# EAGLE design comms_sys_schematic_no_ch340G (EAGLE 9.5.2)
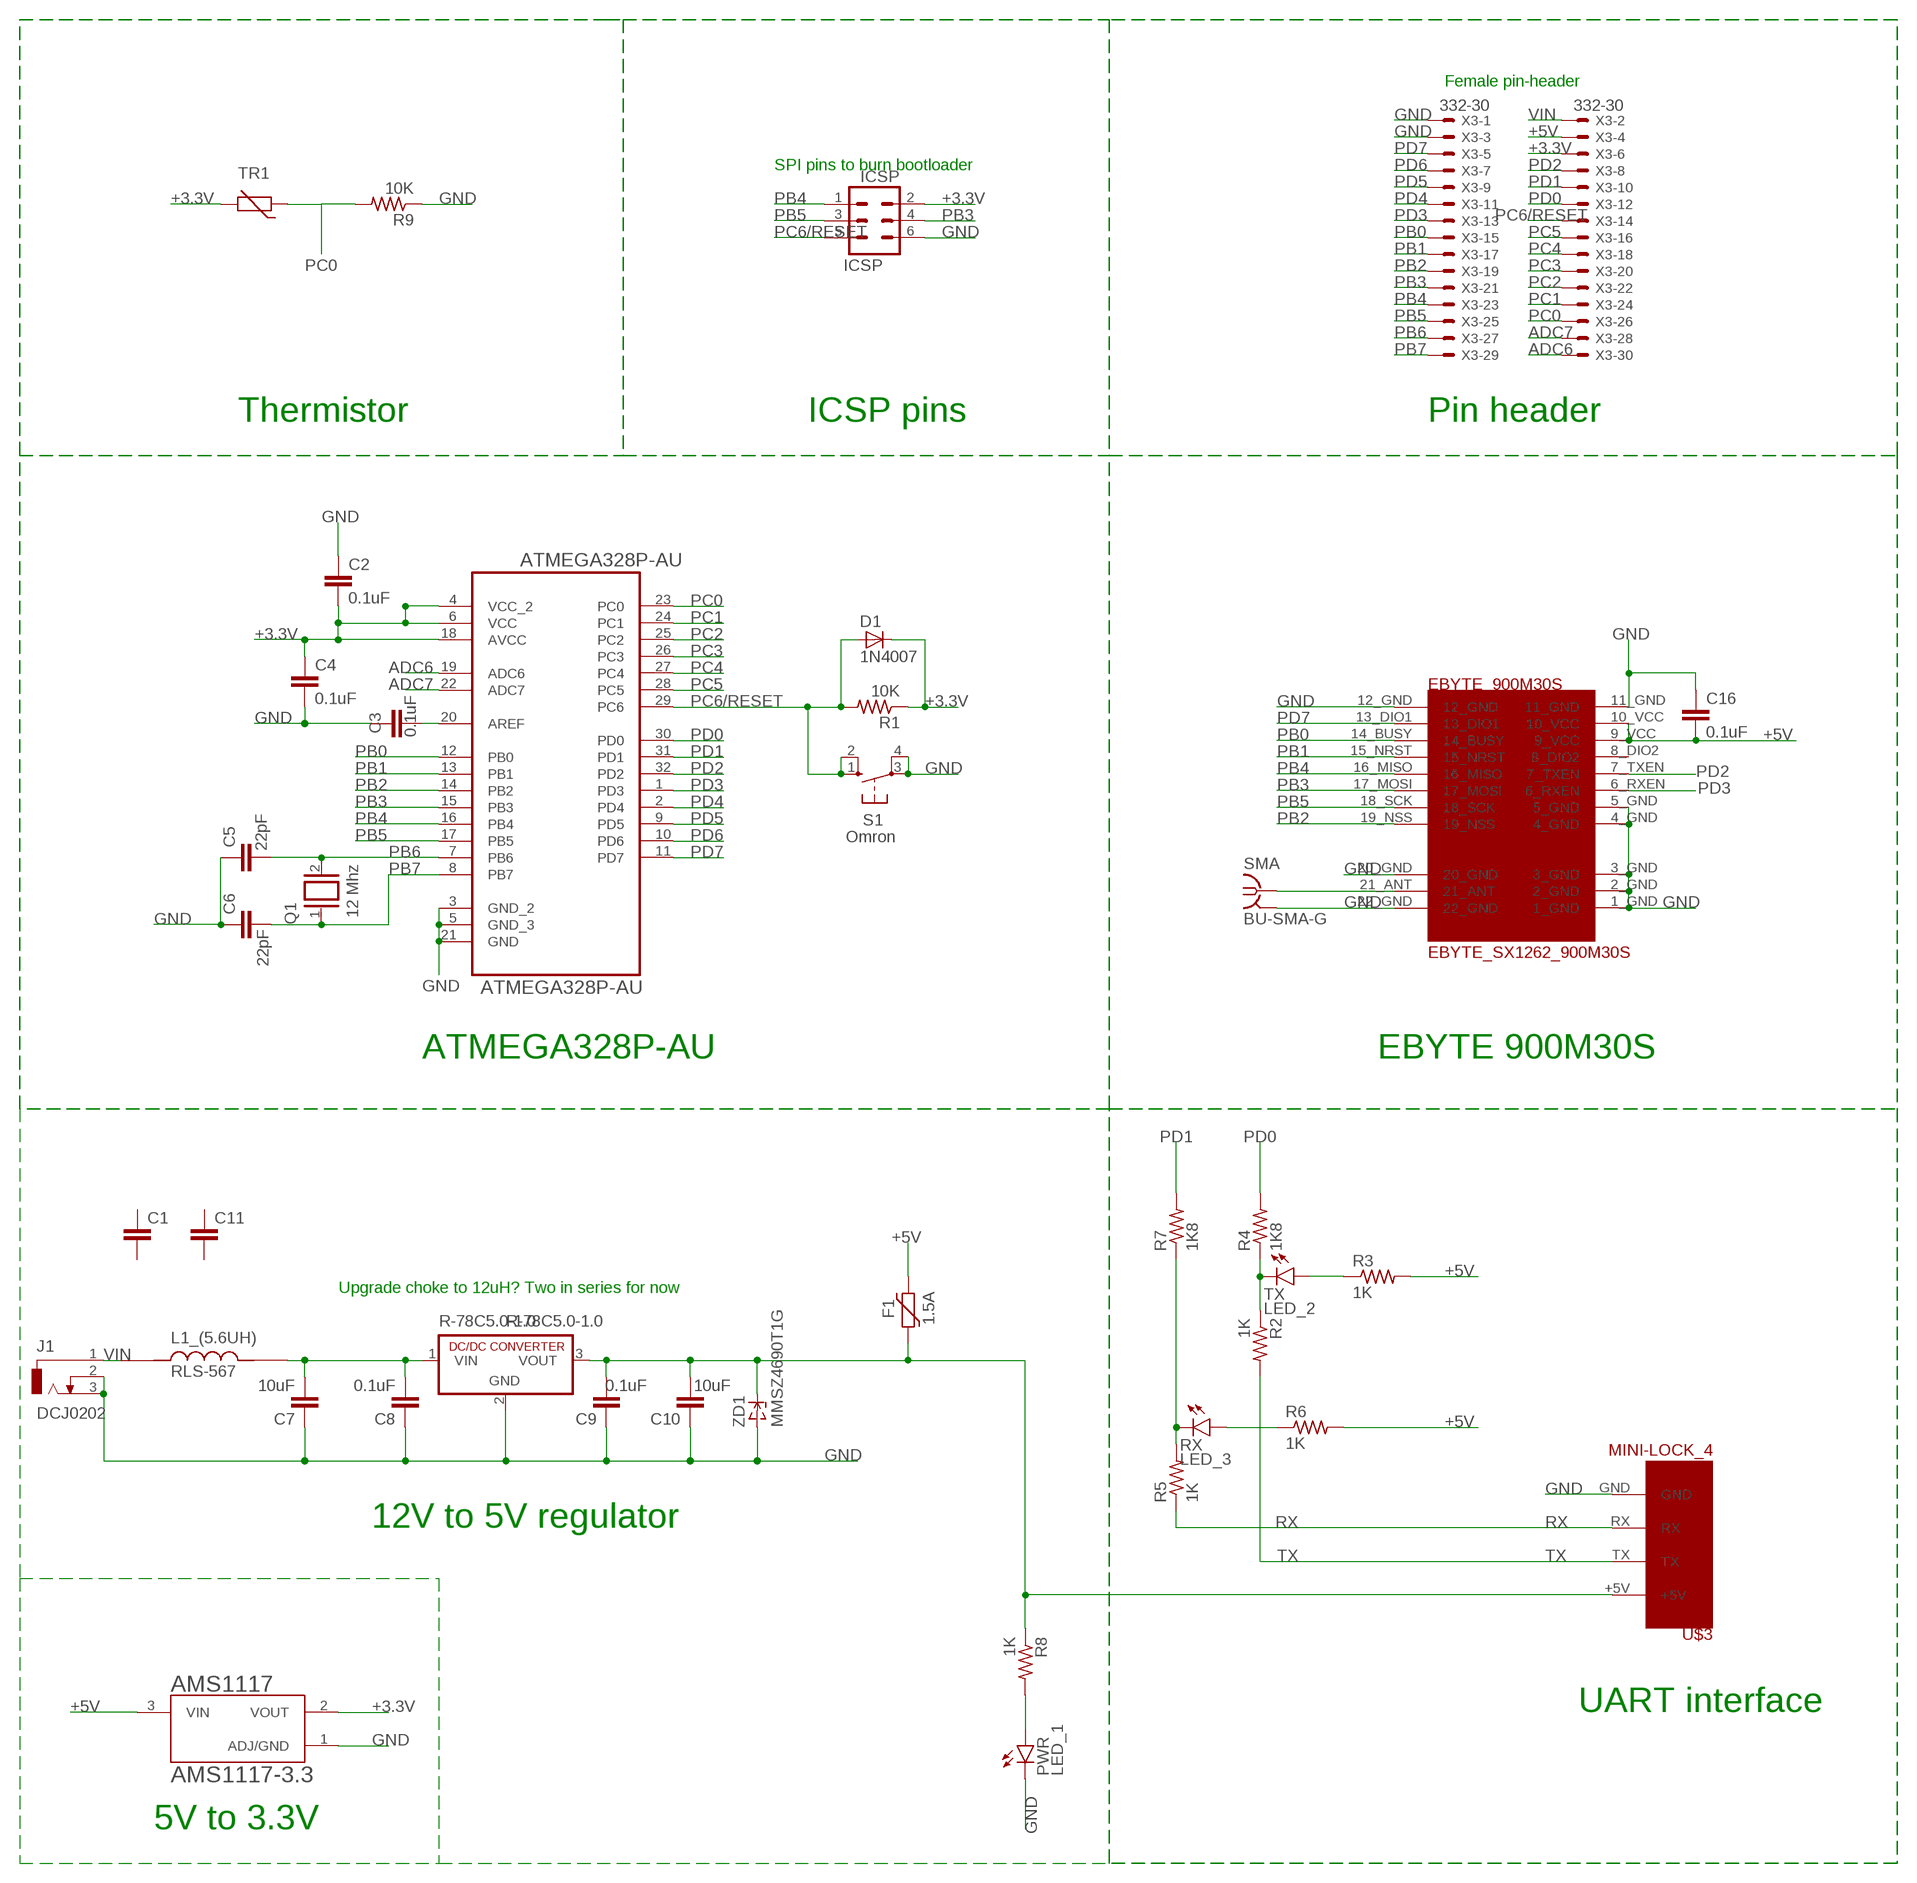
[diagram p0: schematic, sheet 1]

## Parts
AMS1117  AMS1117-3.3  [SOT229P700X180-4N]
ATMEGA328P-AU  ATMEGA328P-AU  [QFP80P900X900X120-32N]
C1  C-EUC1206  [C1206]
C2  0.1uF  C-EUC0805  [C0805]
C3  0.1uF  C-EUC0805  [C0805]
C4  0.1uF  C-EUC0805  [C0805]
C5  22pF  C-EUC0805  [C0805]
C6  22pF  C-EUC0805  [C0805]
C7  10uF  C-EUC0805  [C0805]
C8  0.1uF  C-EUC0805  [C0805]
C9  0.1uF  C-EUC0805  [C0805]
C10  10uF  C-EUC0805  [C0805]
C11  C-EUC1206  [C1206]
C16  0.1uF  C-EUC0805  [C0805]
D1  1N4007  [SMA]
EBYTE_900M30S  EBYTE_SX1262_900M30S  [EBYTE_SX1262_900M30S_FOOTPRINT]
F1  1.5A  FUSE_PTC-0805  [PTC0805]
ICSP  ICSP  MA03-2  [MA03-2]
J1  DCJ0202  [DCJ0202]
L1_(5.6UH)  RLS-567  [IND_RLS-567]
PWR  LED_1  LEDCHIP-LED0805  [CHIP-LED0805]
Q1  12 Mhz  XTAL/S  [QS]
R1  10K  R-US_R0805  [R0805]
R2  1K  R-US_R0805  [R0805]
R3  1K  R-US_R0805  [R0805]
R4  1K8  R-US_R0805  [R0805]
R5  1K  R-US_R0805  [R0805]
R6  1K  R-US_R0805  [R0805]
R7  1K8  R-US_R0805  [R0805]
R8  1K  R-US_R0805  [R0805]
R9  10K  R-US_R0805  [R0805]
R-78C5.0-1.0  R-78C5.0-1.0  [SIP3]
RX  LED_3  LEDCHIP-LED0805  [CHIP-LED0805]
S1  Omron  10-XX  [B3F-10XX]
SMA  BU-SMA-G  [BU-SMA-G]
TR1  THERMISTOR_R-2,5  [RS-2,5]
TX  LED_2  LEDCHIP-LED0805  [CHIP-LED0805]
U$3  MINI-LOCK_4  [MINI-LOCK_4]
X3  332-30  [332-30]
ZD1  MMSZ4690T1G  ZENERSOD-123  [SOD-123]

## Nets
+3.3V: AMS1117.2(VOUT) ATMEGA328P-AU.4(VCC_2) ATMEGA328P-AU.6(VCC) ATMEGA328P-AU.18(AVCC) C2.2 C4.1 D1.K(C) ICSP.2 R1.1 TR1.2 X3.6
+5V: AMS1117.3(VIN) C16.2 EBYTE_900M30S.9_VCC EBYTE_900M30S.10_VCC F1.2 R3.2 R6.2 X3.4
ADC6: ATMEGA328P-AU.19(ADC6) X3.30
ADC7: ATMEGA328P-AU.22(ADC7) X3.28
GND: AMS1117.1(ADJ/GND) ATMEGA328P-AU.3(GND_2) ATMEGA328P-AU.5(GND_3) ATMEGA328P-AU.21(GND) C2.1 C3.1 C4.2 C5.1 C6.1 C7.1 C8.1 C9.1 C10.1 C16.1 EBYTE_900M30S.1_GND EBYTE_900M30S.2_GND EBYTE_900M30S.3_GND EBYTE_900M30S.4_GND EBYTE_900M30S.5_GND EBYTE_900M30S.11_GND EBYTE_900M30S.12_GND EBYTE_900M30S.20_GND EBYTE_900M30S.22_GND ICSP.6 J1.2 J1.3 PWR.C R9.1 R-78C5.0-1.0.2(GND) S1.3(P) S1.4(P1) SMA.2 SMA.3 SMA.4 SMA.5 U$3.GND X3.1 X3.3 ZD1.A
N$1: C9.2 C10.2 F1.1 R8.1 R-78C5.0-1.0.3(VOUT) U$3.+5V ZD1.C
N$4: PWR.A R8.2
N$8: EBYTE_900M30S.21_ANT SMA.1
N$12: R3.1 TX.A
N$14: ATMEGA328P-AU.20(AREF) C3.2
N$16: R6.1 RX.A
N$24: R2.1 R4.1 TX.C
N$25: R5.2 R7.1 RX.C
N$27: C7.2 C8.2 L1_(5.6UH).2 R-78C5.0-1.0.1(VIN)
PB0: ATMEGA328P-AU.12(PB0) EBYTE_900M30S.14_BUSY X3.15
PB1: ATMEGA328P-AU.13(PB1) EBYTE_900M30S.15_NRST X3.17
PB2: ATMEGA328P-AU.14(PB2) EBYTE_900M30S.19_NSS X3.19
PB3: ATMEGA328P-AU.15(PB3) EBYTE_900M30S.17_MOSI ICSP.4 X3.21
PB4: ATMEGA328P-AU.16(PB4) EBYTE_900M30S.16_MISO ICSP.1 X3.23
PB5 [SCK]: ATMEGA328P-AU.17(PB5) EBYTE_900M30S.18_SCK ICSP.3 X3.25
PB6: ATMEGA328P-AU.7(PB6) C5.2 Q1.2 X3.27
PB7: ATMEGA328P-AU.8(PB7) C6.2 Q1.1 X3.29
PC0: ATMEGA328P-AU.23(PC0) R9.2 TR1.1 X3.26
PC1: ATMEGA328P-AU.24(PC1) X3.24
PC2: ATMEGA328P-AU.25(PC2) X3.22
PC3: ATMEGA328P-AU.26(PC3) X3.20
PC4: ATMEGA328P-AU.27(PC4) X3.18
PC5: ATMEGA328P-AU.28(PC5) X3.16
PC6/RESET: ATMEGA328P-AU.29(PC6) D1.A ICSP.5 R1.2 S1.1(S) S1.2(S1) X3.14
PD0: ATMEGA328P-AU.30(PD0) R4.2 X3.12
PD1: ATMEGA328P-AU.31(PD1) R7.2 X3.10
PD2: ATMEGA328P-AU.32(PD2) EBYTE_900M30S.7_TXEN X3.8
PD3: ATMEGA328P-AU.1(PD3) EBYTE_900M30S.6_RXEN X3.13
PD4: ATMEGA328P-AU.2(PD4) X3.11
PD5: ATMEGA328P-AU.9(PD5) X3.9
PD6: ATMEGA328P-AU.10(PD6) X3.7
PD7: ATMEGA328P-AU.11(PD7) EBYTE_900M30S.13_DIO1 X3.5
RX: R5.1 U$3.RX
TX: R2.2 U$3.TX
VIN: J1.1 L1_(5.6UH).1 X3.2
Unconnected: C1.1 C1.2 C11.1 C11.2 EBYTE_900M30S.8_DIO2

## Notes on the sheet
- Female pin-header
- SPI pins to burn bootloader
- Thermistor | ICSP pins | Pin header
- ATMEGA328P-AU | EBYTE 900M30S
- Upgrade choke to 12uH? Two in series for now
- 12V to 5V regulator
- UART interface
- 5V to 3.3V

## Library data of the parts
AMS1117 = AMS1117-3.3:AMS1117-3.3: Sot223/Pkg 1-Amp 3.3-Volt Low Drop Out Voltage Regulatator; AVAILABILITY: Unavailable; DESCRIPTION: Sot223/Pkg 1-Amp 3.3-Volt Low Drop Out Voltage Regulatator; MF: Advanced Monolithic Systems; MP: AMS1117-3.3; PACKAGE: None; PRICE: None
ATMEGA328P-AU = Atmel_By_element14_Batch_1-00:ATMEGA328P-AU: 8-bit Microcontroller with In-System Programmable Flash; MPN: ATMEGA328P-AU; OC_FARNELL: 1715486; OC_NEWARK: 14R4631; PACKAGE: TQFP-32; SUPPLIER: Atmel
C1-C11 C16 = rcl:C-EU: CAPACITOR, European symbol; SPICEPREFIX: C
D1 = casovac:1N4007
EBYTE_900M30S = cust_parts:EBYTE_SX1262_900M30S
F1 = dp_devices.v6:FUSE_PTC: Resettable PTC
ICSP = con-lstb:MA03-2: PIN HEADER; OC_FARNELL: unknown; OC_NEWARK: unknown
J1 = con-jack:DCJ0202: DC POWER JACK Source: DCJ0202.pdf; OC_FARNELL: unknown; OC_NEWARK: unknown
L1_(5.6UH) = RLS-567:RLS-567: Line Inductors for RECOM Power Supply; AVAILABILITY: Unavailable; DESCRIPTION: Line Inductors for RECOM Power Supply; DIGIKEY-PURCHASE-URL: https://snapeda.com/shop?store=DigiKey&id=3641543; MF: Recom Power; MP: RLS-567; PACKAGE: 1812 Recom Power; PRICE: None
PWR RX TX = led:LED: LED OSRAM: - CHIPLED LG R971, LG N971, LY N971, LG Q971, LY Q971, LO R971, LY R971 LH N974, LH R974 LS Q976, LO Q976, LY Q976 LO Q996 - Hyper CHIPLED LW Q18S LB Q993, LB Q99A, LB R99A - SideLED LS A670, LO A670, LY A670, LG A670, LP A670 LB A673, LV A673, LT A673, LW A673 LH A674 LY A675 LS A676, LA A676, LO A676, LY A676, LW A676 LS A679, LY A679, LG A679 - Hyper Micro SIDELED® LS Y876, LA Y876, LO Y876, LY Y876 LT Y87S - SmartLED LW L88C, LW L88S LB L89C, LB L89S, LG L890 LS L89K, LO L89K, LY L89K LS L896, LA L896, LO L896, LY L896 - TOPLED LS T670, LO T670, LY T670, LG T670, LP T670 LSG T670, LSP T670, LSY T670, LOP T670, LYG T670 LG T671, LOG T671, LSG T671 LB T673, LV T673, LT T673, LW T673 LH T674 LS T676, LA T676, LO T676, LY T676, LB T676, LH T676, LSB T676, LW T676 LB T67C, LV T67C, LT T67C, LS T67K, LO T67K, LY T67K, LW E67C LS E67B, LA E67B, LO E67B, LY E67B, LB E67C, LV E67C, LT E67C LW T67C LS T679, LY T679, LG T679 LS T770, LO T770, LY T770, LG T770, LP T770 LB T773, LV T773, LT T773, LW T773 LH T774 LS E675, LA E675, LY E675, LS T675 LS T776, LA T776, LO T776, LY T776, LB T776 LHGB T686 LT T68C, LB T68C - Hyper Mini TOPLED® LB M676 - Mini TOPLED Santana® LG M470 LS M47K, LO M47K, LY M47K Source: http://www.osram.convergy.de LUXEON: - LUMILED® LXK2-PW12-R00, LXK2-PW12-S00, LXK2-PW14-U00, LXK2-PW14-V00 LXK2-PM12-R00, LXK2-PM12-S00, LXK2-PM14-U00 LXK2-PE12-Q00, LXK2-PE12-R00, LXK2-PE12-S00, LXK2-PE14-T00, LXK2-PE14-U00 LXK2-PB12-K00, LXK2-PB12-L00, LXK2-PB12-M00, LXK2-PB14-N00, LXK2-PB14-P00, LXK2-PB14-Q00 LXK2-PR12-L00, LXK2-PR12-M00, LXK2-PR14-Q00, LXK2-PR14-R00 LXK2-PD12-Q00, LXK2-PD12-R00, LXK2-PD12-S00 LXK2-PH12-R00, LXK2-PH12-S00 LXK2-PL12-P00, LXK2-PL12-Q00, LXK2-PL12-R00 Source: www.luxeon.com KINGBRIGHT: KA-3528ASYC Source: www.kingbright.com
Q1 = special:XTAL/S: CRYSTAL
R1-R9 = rcl:R-US_: RESISTOR, American symbol; SPICEPREFIX: R
R-78C5.0-1.0 = dc-dc-converter:R-78C*-1.0: INNOLINE DC/DC-Converter 1.0 AMP SIP3 Single Output Source: Data sheet <http://www.mikrocontroller.net/attachment/150645/157764-da-01-en-DC_DC_WANDLER_R_78C5_0_1_0.pdf>
S1 = switch-omron:10-XX: OMRON SWITCH; MPN: B3F-1000; OC_FARNELL: 176432; OC_NEWARK: 36M3542
SMA = con-coax:BU-SMA-G: FEMALE SMA CONNECTOR Radiall distributor RS 193-9117; OC_FARNELL: unknown; OC_NEWARK: unknown
TR1 = discrete:THERMISTOR_: Thermo Resistor
U$3 = cust_parts:MINI-LOCK_4
X3 = con-garry:332-30: 30 Pin - 2mm Dual Row Source: www.mpe-connector.de / garry_shortform_2012.pdf
ZD1 = dp_devices.v6:ZENER: Zener Diode SOD-323

## Board
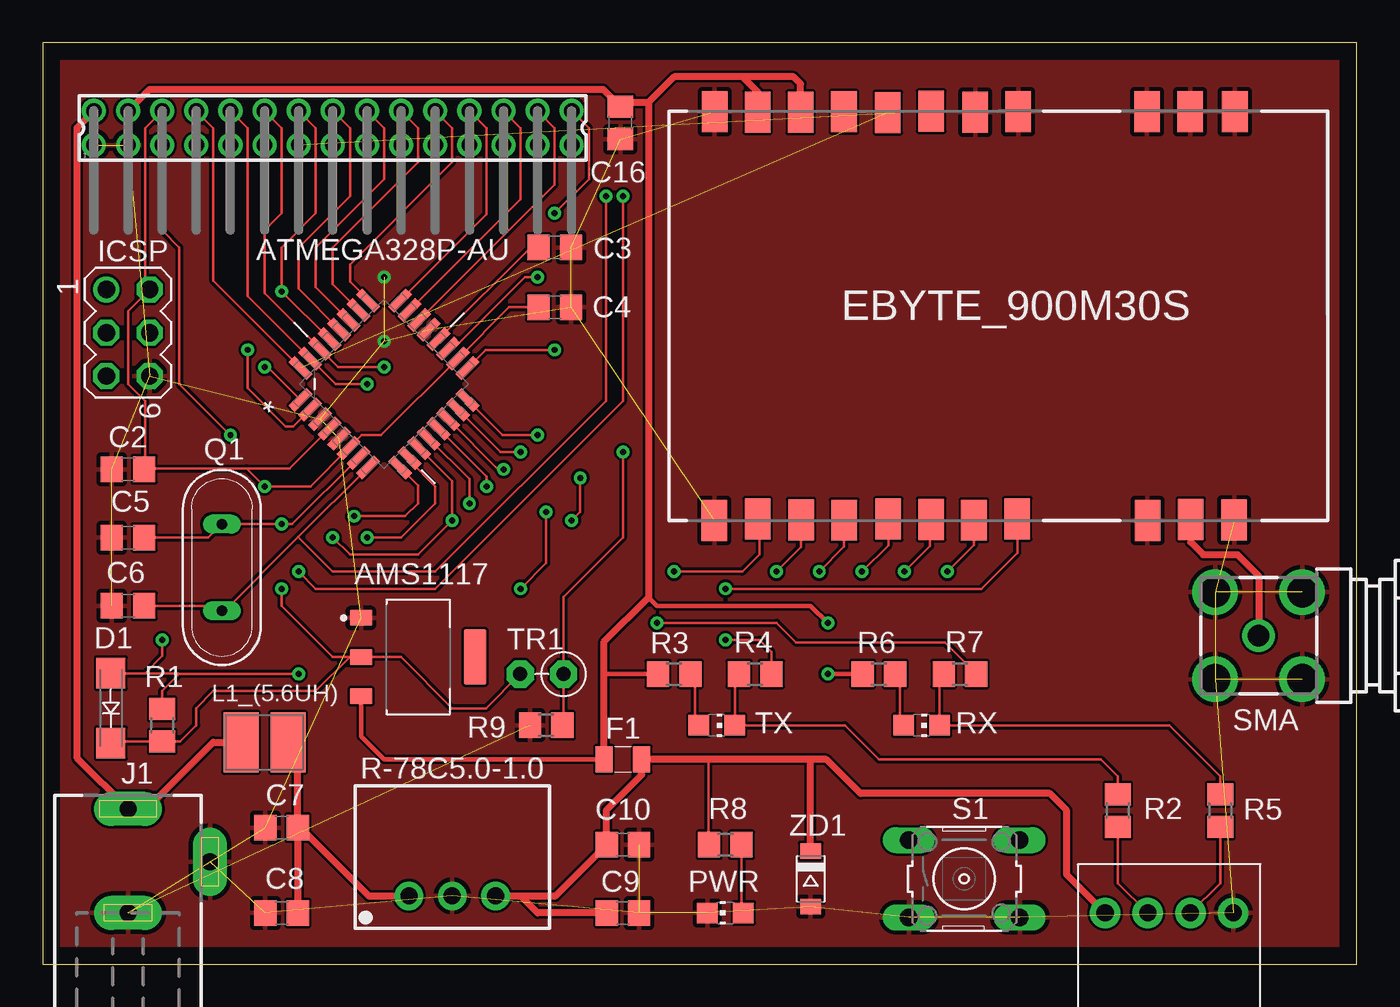
[diagram p1: board, top side]
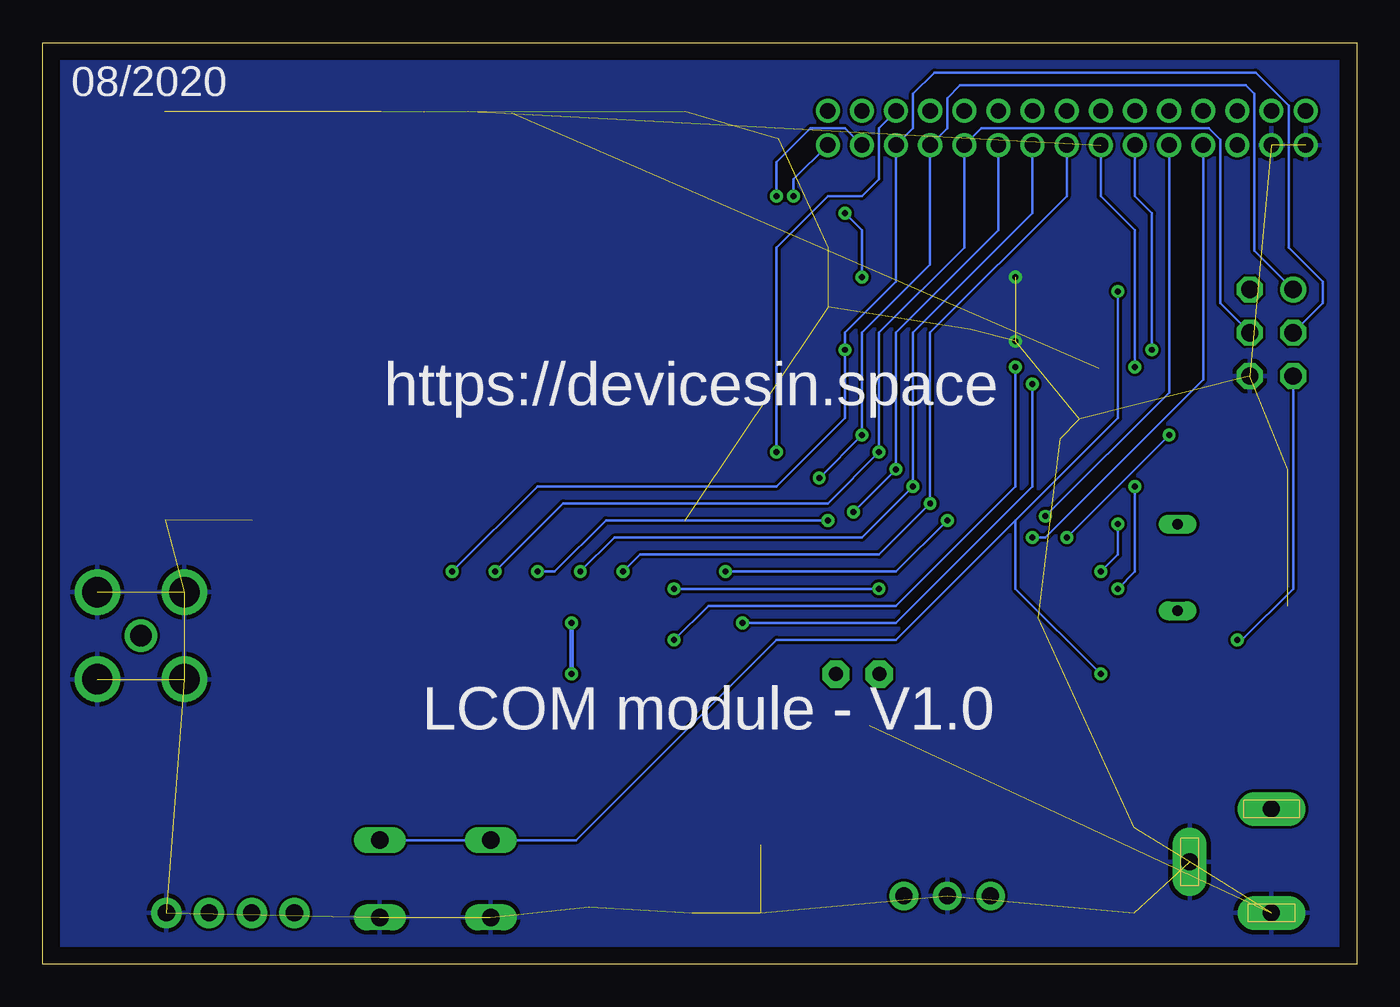
[diagram p2: board, bottom side, seen from below]

Size 77 x 54 mm. Coordinates in mm from the lower left corner, seen from the top.
Outline: 0,0 77,0 77,54 0,54 0,0
Copper layers (1*16): Top 0.035mm / dielectric 1.5mm / Bottom 0.035mm
Design rules "default": minimum track width 6mil, minimum drill 0.35mm, track to track 6mil, track to pad 6mil, pad to pad 6mil, via to via 6mil, smd to smd 6mil, copper to edge 40mil, drill to drill 6mil, minimum pad ring 10mil, minimum via ring 8mil, stop-mask expansion 4mil, vias tented up to drill 0mil, thermal gap 10mil

### Footprints (pad centres in the part's own frame; a part is rotated, then mirrored left to right if it is on the bottom)
SOT229P700X180-4N = smd 0.93 x 1.31: 1 -2.29,-3.345; 2 0,-3.345; 3 2.29,-3.345 | smd 3.24 x 1.31: 4 0,3.345
QFP80P900X900X120-32N = smd 1.473 x 0.508: 1 -4.115,2.794; 2 -4.115,2.007; 3 -4.115,1.194; 4 -4.115,0.406; 5 -4.115,-0.406; 6 -4.115,-1.194; 7 -4.115,-2.007; 8 -4.115,-2.794; 17 4.115,-2.794; 18 4.115,-2.007; 19 4.115,-1.194; 20 4.115,-0.406; 21 4.115,0.406; 22 4.115,1.194; 23 4.115,2.007; 24 4.115,2.794 | smd 0.508 x 1.473: 9 -2.794,-4.115; 10 -2.007,-4.115; 11 -1.194,-4.115; 12 -0.406,-4.115; 13 0.406,-4.115; 14 1.194,-4.115; 15 2.007,-4.115; 16 2.794,-4.115; 25 2.794,4.115; 26 2.007,4.115; 27 1.194,4.115; 28 0.406,4.115; 29 -0.406,4.115; 30 -1.194,4.115; 31 -2.007,4.115; 32 -2.794,4.115
C1206 = smd 1.6 x 1.8: 1 -1.4,0; 2 1.4,0
C0805 = smd 1.3 x 1.5: 1 -0.95,0; 2 0.95,0
SMA = smd 1.8 x 1.7: A -2.05,0; K 2.05,0
EBYTE_SX1262_900M30S_FOOTPRINT = smd 2.4 x 1.5: 1_GND 11.946,-13.848; 2_GND 11.953,-11.232; 3_GND 11.946,-8.7; 4_GND 11.946,-1.155; 5_GND 11.915,1.361; 6_RXEN 11.984,3.939; 7_TXEN 11.907,6.479; 8_DIO2 11.953,9.049; 9_VCC 11.915,11.589; 10_VCC 11.938,14.113; 11_GND 11.946,16.622; 12_GND -11.991,16.645; 13_DIO1 -11.917,14.112; 14_BUSY -11.965,11.563; 15_NRST -11.986,9.038; 16_MISO -11.914,6.456; 17_MOSI -11.937,3.938; 18_SCK -11.986,1.435; 19_NSS -11.907,-1.1; 20_GND -11.992,-8.731; 21_ANT -11.93,-11.263; 22_GND -11.961,-13.818
PTC0805 = smd 1 x 1.5: 1 -1.1,0; 2 1.1,0
MA03-2 = drill 1.016: 1 -2.54,-1.27 | drill 1.016 octagon: 2 -2.54,1.27; 3 0,-1.27; 4 0,1.27; 5 2.54,-1.27; 6 2.54,1.27
DCJ0202 = drill 1 pad 2 long: 1 0,3.1; 2 4.8,0; 3 0,-3
IND_RLS-567 = smd 2.05 x 3.5: 1 -1.375,0; 2 1.375,0
CHIP-LED0805 = smd 1.2 x 1.2: A 0,-1.05; C 0,1.05
QS = drill 0.61 long: 1 -2.54,0; 2 2.54,0
R0805 = smd 1.3 x 1.5: 1 -0.95,0; 2 0.95,0
SIP3 = drill 1 pad 1.676: 1 -2.54,0; 2 0,0; 3 2.54,0
B3F-10XX = drill 1.016 long: 1 -3.251,2.261; 2 3.251,2.261; 3 -3.251,-2.261; 4 3.251,-2.261
BU-SMA-G = drill 1.27: 1 0,0 | drill 1.778: 2 -2.55,2.55; 3 2.55,2.55; 4 2.55,-2.55; 5 -2.55,-2.55
RS-2,5 = drill 0.813 pad 1.6 octagon: 1 -1.27,0; 2 1.27,0
MINI-LOCK_4 = drill 1 pad 1.778: +5V 0,3.75; GND 0,-3.75; RX 0,-1.25; TX 0,1.25
332-30 = drill 0.9 pad 1.27: 1 -14,-1; 2 -14,1; 3 -12,-1; 4 -12,1; 5 -10,-1; 6 -10,1; 7 -8,-1; 8 -8,1; 9 -6,-1; 10 -6,1; 11 -4,-1; 12 -4,1; 13 -2,-1; 14 -2,1; 15 0,-1; 16 0,1; 17 2,-1; 18 2,1; 19 4,-1; 20 4,1; 21 6,-1; 22 6,1; 23 8,-1; 24 8,1; 25 10,-1; 26 10,1; 27 12,-1; 28 12,1; 29 14,-1; 30 14,1
SOD-123 = smd 0.91 x 1.22: A 1.635,0; C -1.635,0

### Placement (x,y rotation side)
AMS1117  22,18 270 top
ATMEGA328P-AU  20,34 45 top
C1  -18,13 0 top  (outside the outline)
C2  5,29 0 top
C3  30,42 180 top
C4  30,38.5 0 top
C5  5,25 0 top
C6  5,21 0 top
C7  14,8 0 top
C8  14,3 0 top
C9  34,3 180 top
C10  34,7 180 top
C11  -18,7 0 top  (outside the outline)
C16  33.85,49.3 90 top
D1  4,15 270 top
EBYTE_900M30S  56,38 90 top
F1  34,12 180 top
ICSP  5,37 270 top
J1  5,6 0 top
L1_(5.6UH)  13,13 0 top
PWR  40,3 90 top
Q1  10.5,23.25 90 top
R1  7,14 90 top
R2  63,9 270 top
R3  37,17 180 top
R4  41.75,17 0 top
R5  69,9 90 top
R6  49,17 180 top
R7  53.75,17 0 top
R8  40,7 0 top
R9  29.5,14 0 top
R-78C5.0-1.0  24,4 0 top
RX  51.5,14 270 top
S1  54,5 0 top
SMA  71.25,19.25 0 top
TR1  29.25,17 180 top
TX  39.5,14 270 top
U$3  66,3 90 top
X3  17,49 0 top
ZD1  45,5 270 top

### Tracks (layer width: path | path; a pad name or v marks a point on that pad's centre or on a via)
+3.3V  (via drill 0.35)
  Top 0.152: C4.1 27.34,38.5 ATMEGA328P-AU.18 19.84,31 18.69,31 ATMEGA328P-AU.6 15.69,28 v13,28 11.95,29.05 | 18.66,17.66 AMS1117.2 | X3.6 6,49 6,39.81 ICSP.2 5,38.27 5,34 6,33 6,29.05 | 6,29.05 C2.2 | 6,29.05 11.95,29.05 | 11.95,29.05 14.47,29.05 ATMEGA328P-AU.4 | D1.K 4.1,13.05 R1.1 8.05,13.05 9,14 9,15 10,16 16,16 18,18 | AMS1117.2 18,18 | 18,18 17,18 14,21 v14,22 | TR1.2 25.98,15 24,15 21,18 AMS1117.2
  Bottom 0.152: v14,22 13,23 v13,28
+5V  (via drill 0.35)
  Top 0.254: 32.9,17 R3.2 | R6.2 v46,17 | 35.5,21.5 36,21 45,21 v46,20 | EBYTE_900M30S.10_VCC 41.89,51.11 | C16.2 34.1,50.5 | AMS1117.3 18.66,13.35 20,12 F1.2
  Top 0.406: F1.2 32.9,17 32.9,18.9 35.5,21.5 35.5,50.5 | 41.89,51.11 41,52 | 41,52 37,52 35.5,50.5 | X3.4 6.25,51.25 32.85,51.25 C16.2 | 34.1,50.5 35.5,50.5 | EBYTE_900M30S.9_VCC 44.41,51.59 44,52 41,52
  Bottom 0.254: v46,20 v46,17
ADC6  (via drill 0.35)
  Top 0.152: ATMEGA328P-AU.19 24.07,36.06 28.25,40.25 v29,40.25 | v30,44 32,46 32,49 X3.30
  Bottom 0.152: v29,40.25 29,43 v30,44
ADC7
  Top 0.152: ATMEGA328P-AU.22 30,45.69 30,49 X3.28
GND  (via drill 0.35)  (40 unrouted)
  other vias: 20,40.25 20,36.5
  pour Top: -3,56 -3,-6 -2,-7 74,-7 81,0 81,54 78,57 -2,57
  pour Bottom: -2,56 -2,0 1,-3 77,-3 79,-1 79,55 78,56
N$1
  Top 0.152: R8.1 39,7.05 39,12
  Top 0.406: R-78C5.0-1.0.3 28,4 | 28,4 30.05,4 C10.2 33.05,9.05 35.1,11.1 F1.1 39,12 45,12 | C9.2 29,3 28,4 | U$3.+5V 60,5.25 60,9 59,10 47.92,10 45.92,12 45,12 | ZD1.C 45,12
N$4
  Top 0.152: R8.2 40.95,3.1 PWR.A
N$8
  Top 0.406: EBYTE_900M30S.21_ANT 67.26,24.74 68,24 70,24 71.25,22.75 SMA.1
N$12
  Top 0.152: R3.1 38.23,16.73 38.23,14.22 TX.A
N$14
  Top 0.152: ATMEGA328P-AU.20 28.57,42 C3.2
N$16
  Top 0.152: R6.1 50.23,16.73 50.23,14.22 RX.A
N$24
  Top 0.152: R4.1 40.55,16.75 TX.C 47,14 49,12 62,12 63,11 R2.1
N$25
  Top 0.152: R7.1 52.55,16.75 RX.C 66,14 69,11 R5.2
N$27
  Top 0.152: 14.69,12.69 L1_(5.6UH).2
  Top 0.254: 14.95,12.43 14.69,12.69 | C7.2 15.11,8
  Top 0.406: R-78C5.0-1.0.1 19.11,4 15.11,8 | 14.95,12.43 C7.2 C8.2
PB0  (via drill 0.35)
  Top 0.152: ATMEGA328P-AU.12 25,28.43 v25,27 | EBYTE_900M30S.14_BUSY 44.44,24.44 v43,23
  Bottom 0.152: X3.15 17,45 25,37 v25,27 28,24 42,24 v43,23
PB1  (via drill 0.35)
  Top 0.152: ATMEGA328P-AU.13 26,28.57 v26,28 | EBYTE_900M30S.15_NRST 46.96,24.46 v45.5,23
  Bottom 0.152: X3.17 19,44 26,37 v26,28 29,25 43.5,25 v45.5,23
PB2  (via drill 0.35)
  Top 0.152: ATMEGA328P-AU.14 26.69,29 v27,29 | v40,22 55,22 57.1,24.1 EBYTE_900M30S.19_NSS | v28,22 29.5,23.5 v29.5,26.5
  Bottom 0.152: X3.19 21,43 27,37 v27,29 v29.5,26.5 | v40,22 v28,22
PB3  (via drill 0.35)
  Top 0.152: ATMEGA328P-AU.15 26.84,30 v28,30 | v50.5,23 52,24.5 52,26 EBYTE_900M30S.17_MOSI
  Bottom 0.152: v50.5,23 46.5,27 31,27 v28,30 28,37 23,42 X3.21 22,49 8.68,49 8,48.32 8,38.73 ICSP.4
PB4  (via drill 0.35)
  Top 0.152: ATMEGA328P-AU.16 26.95,31 v29,31 | EBYTE_900M30S.16_MISO 49.54,24.54 v48,23 | v31,26 31.5,26.5 v31.5,28.5
  Bottom 0.152: v48,23 47,23 44,26 v31,26 | v31.5,28.5 v29,31 29,37 25,41 X3.23 24,49 24,50.75 23.25,51.5 6.5,51.5 6,51 6,41.81 ICSP.1
PB5  (via drill 0.35)
  Top 0.152: ATMEGA328P-AU.17 25.95,36 v30,36 | EBYTE_900M30S.18_SCK 54.56,24.57 v53,23
  Bottom 0.152: v53,23 48,28 34,28 30,32 v30,36 30,37 27,40 X3.25 26,49 26,51 24.75,52.25 5.93,52.25 4,50.32 4,42 2,40 2,38.73 ICSP.3
PB6  (via drill 0.35)
  Top 0.152: ATMEGA328P-AU.7 14.63,25.79 v14,25.79 Q1.2 9.71,25 C5.2 | v34,45 34,33 23,22 16,22 v15,23
  Bottom 0.152: v15,23 14,24 v14,25.79 | X3.27 30,49 32,49 34,47 v34,45
PB7  (via drill 0.35)
  Top 0.152: C6.2 10.21,21 Q1.1 10.66,20.71 14.98,25.02 | 14.98,25.02 ATMEGA328P-AU.8 | v33,45 33,33 23,23 17,23 14.98,25.02
  Bottom 0.152: v33,45 33,46 X3.29
PC0  (via drill 0.35)
  Top 0.152: ATMEGA328P-AU.23 28,44.84 28,49 X3.26 | R9.2 30.52,14.07 TR1.1 30.52,21.52 34,25 v34,30
  Bottom 0.152: X3.26 28,49 28,46 29,45 31,45 34,42 v34,30
PC1
  Top 0.152: ATMEGA328P-AU.24 26,43.95 26,49 X3.24
PC2
  Top 0.152: ATMEGA328P-AU.25 19.07,38.93 18,40 18,41 24,47 24,49 X3.22
PC3
  Top 0.152: ATMEGA328P-AU.26 17,39.84 17,42 22,47 22,49 X3.20
PC4
  Top 0.152: ATMEGA328P-AU.27 16,39.69 16,42 20,46 20,49 X3.18
PC5
  Top 0.152: ATMEGA328P-AU.28 15,39.58 15,42 18,45 18,49 X3.16
PC6/RESET  (via drill 0.35)
  Top 0.152: X3.14 16,49 16,44 14,42 v14,39.42 ATMEGA328P-AU.29 | 8,17 7,16 R1.2 | v15,17 8,17 | D1.A 6,17.05 | 6,17.05 7.95,17.05 8,17 | v7,19 7,18.05 6,17.05
  Bottom 0.152: S1.2 S1.1 45.74,7.26 34,19 27,19 20,26 | v14,39.42 14,32 20,26 | v15,17 20,22 20,26 | ICSP.5 3.73,22 6.73,19 v7,19
PD0  (via drill 0.35)
  Top 0.152: R4.2 42.7,18.3 42,19 v40,19 | X3.12 14,49 14,44 13,43 13,39.31 ATMEGA328P-AU.30 17.31,35 v20,35
  Bottom 0.152: v40,19 38,21 27,21 20,28 v20,35
PD1  (via drill 0.35)
  Top 0.152: R7.2 52.85,18.85 44.15,18.85 43,20 v36,20 | X3.10 12,49 12,39.16 ATMEGA328P-AU.31 17.16,34 v19,34
  Bottom 0.152: v36,20 27,20 19,28 v19,34
PD2  (1 unrouted)
  Top 0.152: ATMEGA328P-AU.32 10,40.05 10,49 X3.8
PD3  (via drill 0.35)  (1 unrouted)
  Top 0.152: ATMEGA328P-AU.1 13.18,35 v13,35
  Bottom 0.152: X3.13 15,45 13,43 v13,35
PD4  (via drill 0.35)
  Top 0.152: ATMEGA328P-AU.2 14.66,31.5 14.25,31.5 12,33.75 v12,36
  Bottom 0.152: v12,36 12,44 13,45 X3.11
PD5  (via drill 0.35)
  Top 0.152: ATMEGA328P-AU.9 22,28.05 22,27 21.25,26.25 v18.25,26.25
  Bottom 0.152: X3.9 11,33.5 v18.25,26.25
PD6  (via drill 0.35)
  Top 0.152: ATMEGA328P-AU.10 21.49,29.51 23,28 23,27 21,25 v19,25
  Bottom 0.152: v19,25 18.25,25 9,34.25 X3.7
PD7  (via drill 0.35)
  Top 0.152: ATMEGA328P-AU.11 24,28.31 v24,26 22,24 18,24 v17,25 | EBYTE_900M30S.13_DIO1 42,25.97 42,24 41,23 v37,23 | v11,31 8,34 8,42 7,43 X3.5
  Bottom 0.152: v37,23 27,23 v24,26 | v17,25 v11,31
RX
  Top 0.152: U$3.RX 69,4.75 R5.1
TX
  Top 0.152: U$3.TX 63,4.75 R2.2
VIN
  Top 0.254: J1.1 6.1,9.1
  Top 0.406: 6.1,9.1 10,13 L1_(5.6UH).1 | X3.2 2,49 2,12.1 J1.1

### Text on the board
bPlace: 08/2020 | https://devicesin.space | LCOM module - V1.0